# Altium schematic sheet ECGLeads.SchDoc
size B
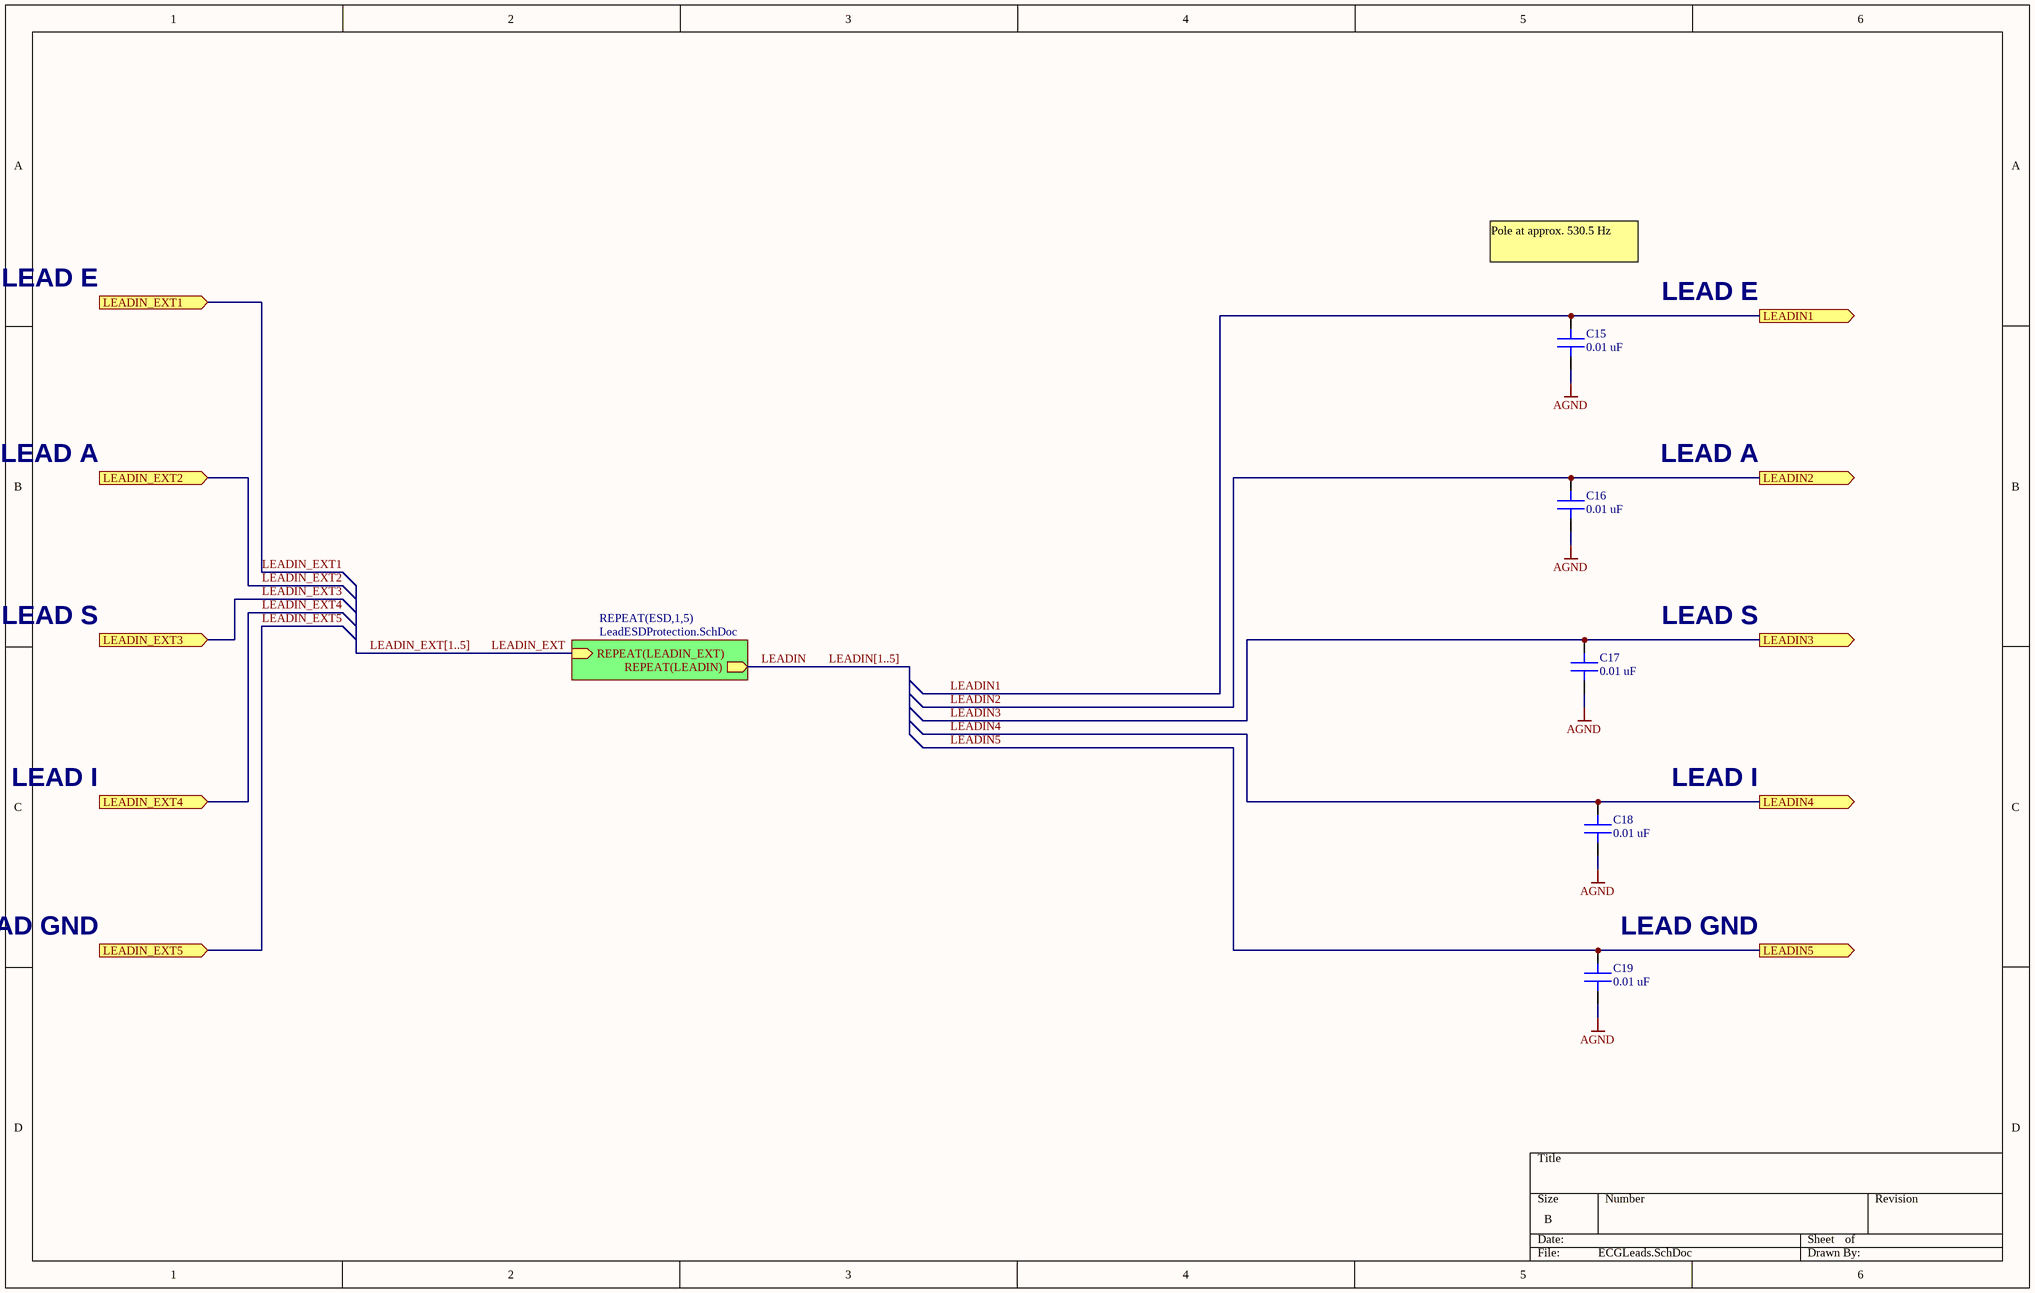
[diagram p0: ECGLeads.SchDoc]

## Parts
C15  value 0.01 uF  [CAP_0603]  (hidden comment: CAP CER 1200PF 50V 10% X7R 0603)
C16  value 0.01 uF  [CAP_0603]  (hidden comment: CAP CER 1200PF 50V 10% X7R 0603)
C17  value 0.01 uF  [CAP_0603]  (hidden comment: CAP CER 1200PF 50V 10% X7R 0603)
C18  value 0.01 uF  [CAP_0603]  (hidden comment: CAP CER 1200PF 50V 10% X7R 0603)
C19  value 0.01 uF  [CAP_0603]  (hidden comment: CAP CER 1200PF 50V 10% X7R 0603)

## Sub-sheets
REPEAT(ESD,1,5) = LeadESDProtection.SchDoc: REPEAT(LEADIN_EXT) (in), REPEAT(LEADIN) (out)

## Ports
LEADIN1 (out), LEADIN2 (out), LEADIN3 (out), LEADIN4 (out), LEADIN5 (out), LEADIN_EXT1 (in), LEADIN_EXT2 (in), LEADIN_EXT3 (in), LEADIN_EXT4 (in), LEADIN_EXT5 (in)

## Nets
AGND: C15.1 C16.1 C17.1 C18.1 C19.1
LEADIN: sheet REPEAT(ESD,1,5)/REPEAT(LEADIN)
LEADIN1: C15.2 ; port LEADIN1
LEADIN2: C16.2 ; port LEADIN2
LEADIN3: C17.2 ; port LEADIN3
LEADIN4: C18.2 ; port LEADIN4
LEADIN5: C19.2 ; port LEADIN5
LEADIN_EXT: sheet REPEAT(ESD,1,5)/REPEAT(LEADIN_EXT)
LEADIN_EXT1: port LEADIN_EXT1
LEADIN_EXT2: port LEADIN_EXT2
LEADIN_EXT3: port LEADIN_EXT3
LEADIN_EXT4: port LEADIN_EXT4
LEADIN_EXT5: port LEADIN_EXT5

## Buses and harness runs
bus LEADIN[1..5]
bus LEADIN_EXT[1..5]

## Notes on the sheet
- LEAD E
- Pole at approx. 530.5 Hz
- LEAD A
- LEAD S
- LEAD I
- LEAD GND

## Library data of the parts
C15 C17-C19 = CAP_GEN: CAP CER 10000PF 50V 10% X7R 0603; Manufacturer: TDK Corporation; Manufacturer Part Number: C1608X7R1H103K080AA
C16 = CAP_GEN: CAP CER 10000PF 50V 10% X7R 0603